# Altium schematic sheet ALS-PT19.SchDoc
size A4
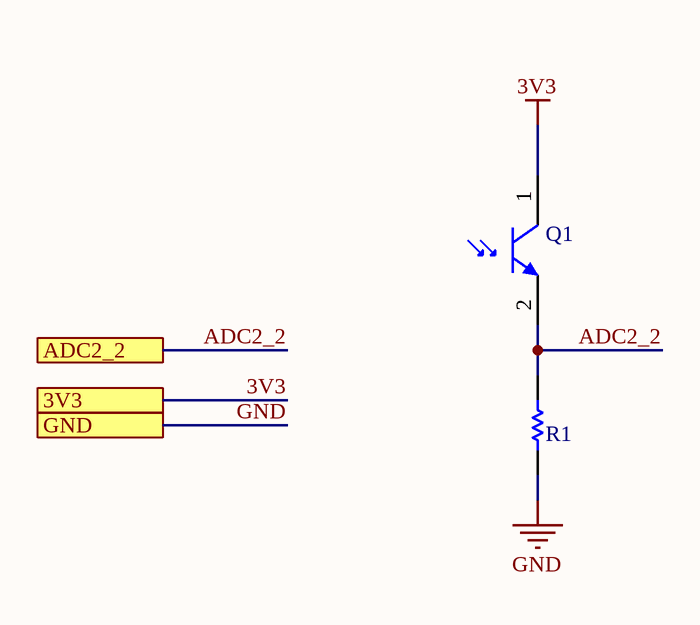
[diagram p0: ALS-PT19.SchDoc]

## Parts
Q1  ALS-PT19-315C/L177/TR8  [2-SMD_ALS-PT19]  (value not drawn)
R1  RK73B2ATTD103J  [RESC2013X60X30NL20T20]  (value not drawn)

## Ports
3V3, ADC2_2, GND

## Nets
3V3: Q1.1(C) ; port 3V3
GND: R1.2 ; port GND
ADC2_2: Q1.2(E) R1.1 ; port ADC2_2

## Library data of the parts
Q1 = ALS-PT19-315C/L177/TR8: Phototransistor 630nm 2-SMD, No Lead; Manufacture: Everlight; Part Number: ALS-PT19-315C/L177/TR8
R1 = CMP-2001-04657-1: 10 kOhms ±5% 0.25W, 1/4W Chip Resistor 0805 (2012 Metric) Automotive AEC-Q200, Moisture Resistant Thick Film; Manufacturer: KOA Speer; Part Number: RK73B2ATTD103J